# EAGLE design SmodCHPX (EAGLE 6.3)
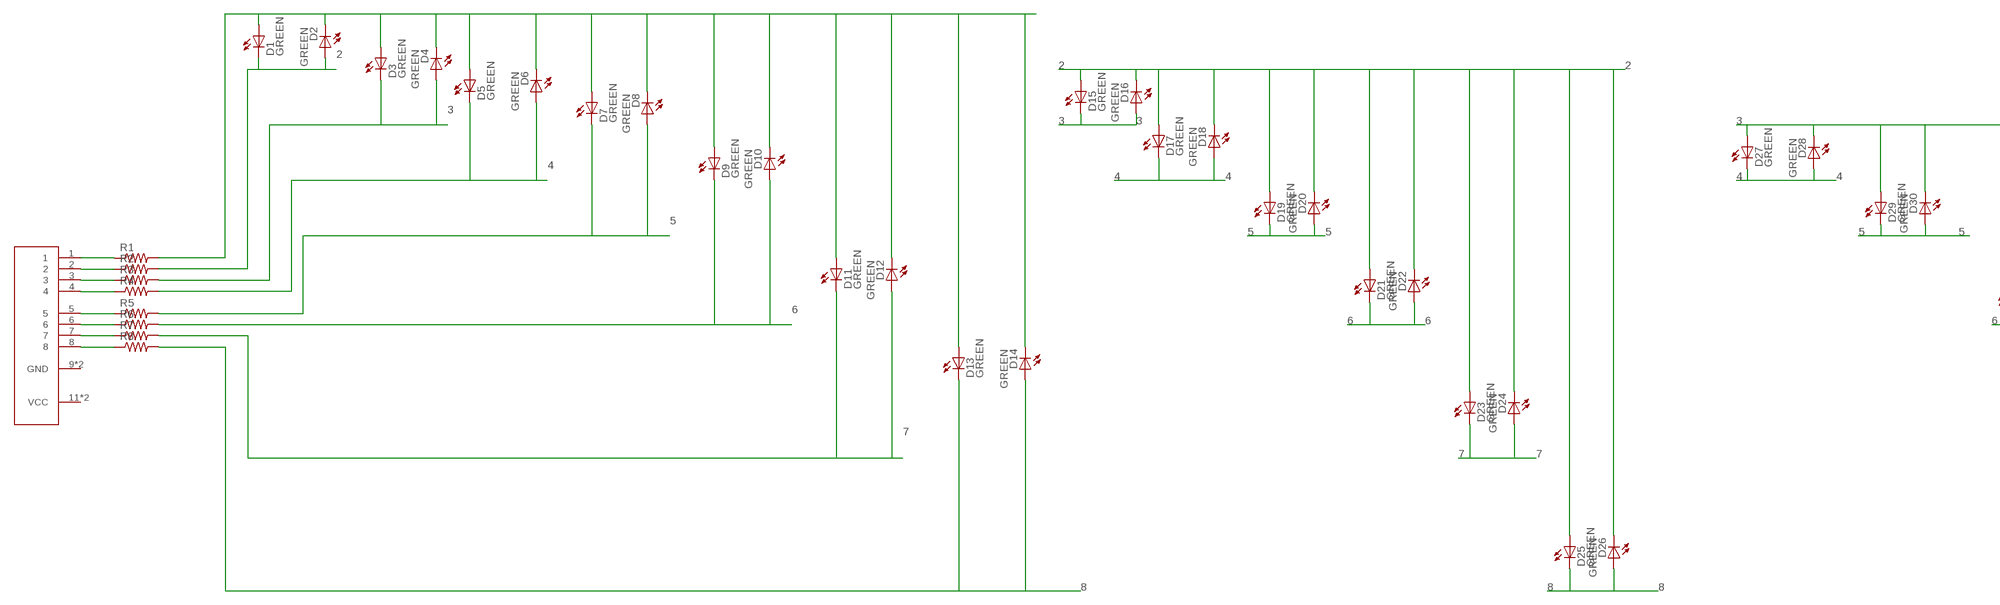
[diagram p0: schematic, sheet 1, part 1 of 2]
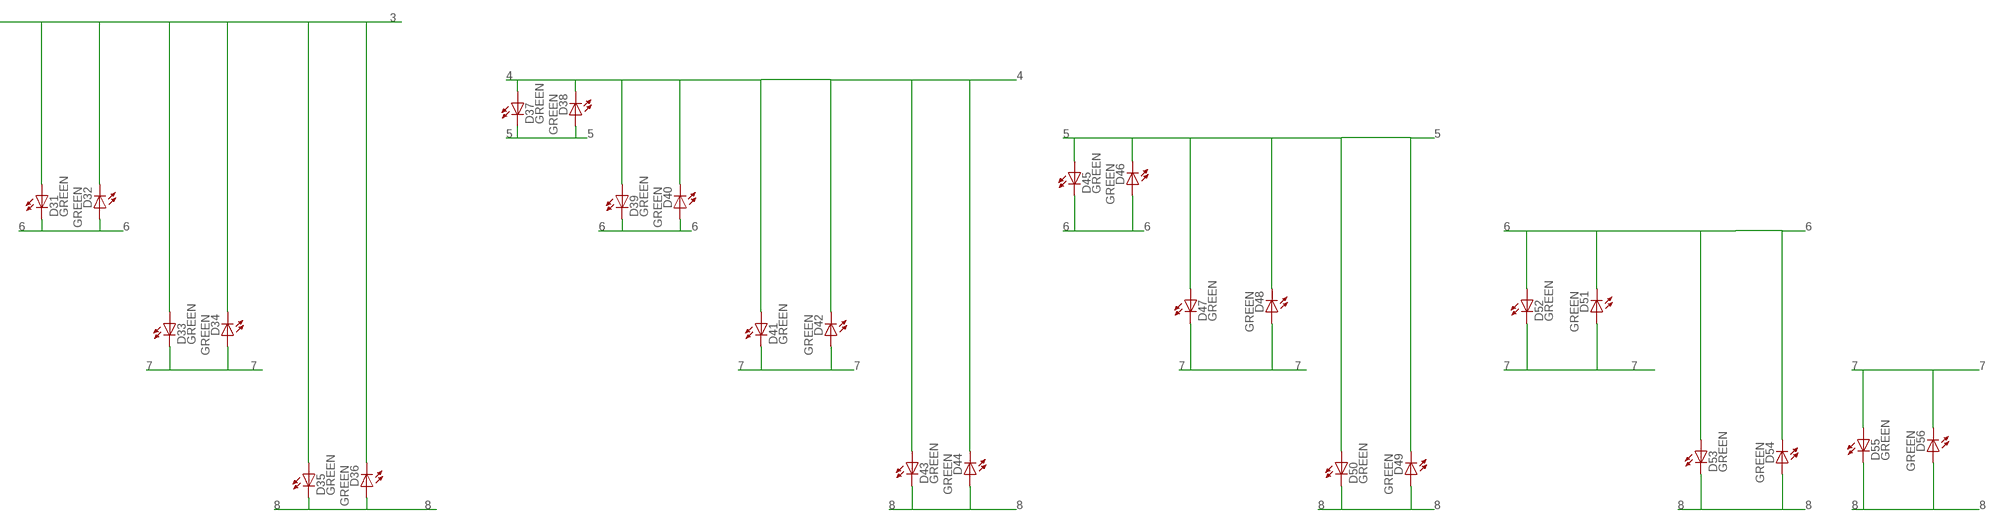
[diagram p1: schematic, sheet 1, part 2 of 2]

## Parts
D1  GREEN  LED-GREENLARGE  [LED-1206]
D2  GREEN  LED-GREENLARGE  [LED-1206]
D3  GREEN  LED-GREENLARGE  [LED-1206]
D4  GREEN  LED-GREENLARGE  [LED-1206]
D5  GREEN  LED-GREENLARGE  [LED-1206]
D6  GREEN  LED-GREENLARGE  [LED-1206]
D7  GREEN  LED-GREENLARGE  [LED-1206]
D8  GREEN  LED-GREENLARGE  [LED-1206]
D9  GREEN  LED-GREENLARGE  [LED-1206]
D10  GREEN  LED-GREENLARGE  [LED-1206]
D11  GREEN  LED-GREENLARGE  [LED-1206]
D12  GREEN  LED-GREENLARGE  [LED-1206]
D13  GREEN  LED-GREENLARGE  [LED-1206]
D14  GREEN  LED-GREENLARGE  [LED-1206]
D15  GREEN  LED-GREENLARGE  [LED-1206]
D16  GREEN  LED-GREENLARGE  [LED-1206]
D17  GREEN  LED-GREENLARGE  [LED-1206]
D18  GREEN  LED-GREENLARGE  [LED-1206]
D19  GREEN  LED-GREENLARGE  [LED-1206]
D20  GREEN  LED-GREENLARGE  [LED-1206]
D21  GREEN  LED-GREENLARGE  [LED-1206]
D22  GREEN  LED-GREENLARGE  [LED-1206]
D23  GREEN  LED-GREENLARGE  [LED-1206]
D24  GREEN  LED-GREENLARGE  [LED-1206]
D25  GREEN  LED-GREENLARGE  [LED-1206]
D26  GREEN  LED-GREENLARGE  [LED-1206]
D27  GREEN  LED-GREENLARGE  [LED-1206]
D28  GREEN  LED-GREENLARGE  [LED-1206]
D29  GREEN  LED-GREENLARGE  [LED-1206]
D30  GREEN  LED-GREENLARGE  [LED-1206]
D31  GREEN  LED-GREENLARGE  [LED-1206]
D32  GREEN  LED-GREENLARGE  [LED-1206]
D33  GREEN  LED-GREENLARGE  [LED-1206]
D34  GREEN  LED-GREENLARGE  [LED-1206]
D35  GREEN  LED-GREENLARGE  [LED-1206]
D36  GREEN  LED-GREENLARGE  [LED-1206]
D37  GREEN  LED-GREENLARGE  [LED-1206]
D38  GREEN  LED-GREENLARGE  [LED-1206]
D39  GREEN  LED-GREENLARGE  [LED-1206]
D40  GREEN  LED-GREENLARGE  [LED-1206]
D41  GREEN  LED-GREENLARGE  [LED-1206]
D42  GREEN  LED-GREENLARGE  [LED-1206]
D43  GREEN  LED-GREENLARGE  [LED-1206]
D44  GREEN  LED-GREENLARGE  [LED-1206]
D45  GREEN  LED-GREENLARGE  [LED-1206]
D46  GREEN  LED-GREENLARGE  [LED-1206]
D47  GREEN  LED-GREENLARGE  [LED-1206]
D48  GREEN  LED-GREENLARGE  [LED-1206]
D49  GREEN  LED-GREENLARGE  [LED-1206]
D50  GREEN  LED-GREENLARGE  [LED-1206]
D51  GREEN  LED-GREENLARGE  [LED-1206]
D52  GREEN  LED-GREENLARGE  [LED-1206]
D53  GREEN  LED-GREENLARGE  [LED-1206]
D54  GREEN  LED-GREENLARGE  [LED-1206]
D55  GREEN  LED-GREENLARGE  [LED-1206]
D56  GREEN  LED-GREENLARGE  [LED-1206]
R1  RESISTOR1206  [1206]
R2  RESISTOR1206  [1206]
R3  RESISTOR1206  [1206]
R4  RESISTOR1206  [1206]
R5  RESISTOR1206  [1206]
R6  RESISTOR1206  [1206]
R7  RESISTOR1206  [1206]
R8  RESISTOR1206  [1206]
U$1  PMOD  [2X6]

## Nets
1: D1.A D2.C D3.A D4.C D5.A D6.C D7.A D8.C D9.A D10.C D11.A D12.C D13.A D14.C R1.2
2: D1.C D2.A D15.A D16.C D17.A D18.C D19.A D20.C D21.A D22.C D23.A D24.C D25.A D26.C R2.2
3: D3.C D4.A D15.C D16.A D27.A D28.C D29.A D30.C D31.A D32.C D33.A D34.C D35.A D36.C R3.2
4: D5.C D6.A D17.C D18.A D27.C D28.A D37.A D38.C D39.A D40.C D41.A D42.C D43.A D44.C R4.2
5: D7.C D8.A D19.C D20.A D29.C D30.A D37.C D38.A D45.A D46.C D47.A D48.C D49.C D50.A R5.2
6: D9.C D10.A D21.C D22.A D31.C D32.A D39.C D40.A D45.C D46.A D51.C D52.A D53.A D54.C R6.2
7: D11.C D12.A D23.C D24.A D33.C D34.A D41.C D42.A D47.C D48.A D51.A D52.C D55.A D56.C R7.2
8: D13.C D14.A D25.C D26.A D35.C D36.A D43.C D44.A D49.A D50.C D53.C D54.A D55.C D56.A R8.2
N$9: R1.1 U$1.1
N$10: R2.1 U$1.2
N$11: R3.1 U$1.3
N$12: R4.1 U$1.4
N$13: R5.1 U$1.5
N$14: R6.1 U$1.6
N$15: R7.1 U$1.7
N$16: R8.1 U$1.8
Unconnected: U$1.9(GND) U$1.10(GND) U$1.11(VCC) U$1.12(VCC)

## Library data of the parts
D1-D56 = SparkFun-LED:LED-GREEN: Various green LEDs 0603- DIO-00821 LARGE- DIO-00862 LILYPAD- DIO-09910; PROD_ID: DIO-00862
R1-R8 = SparkFun-Passives:RESISTOR: Resistor Basic schematic elements and footprints for 0603, 1206, and PTH resistors.
U$1 = Strutz Electronic Industries:PMOD

## Board
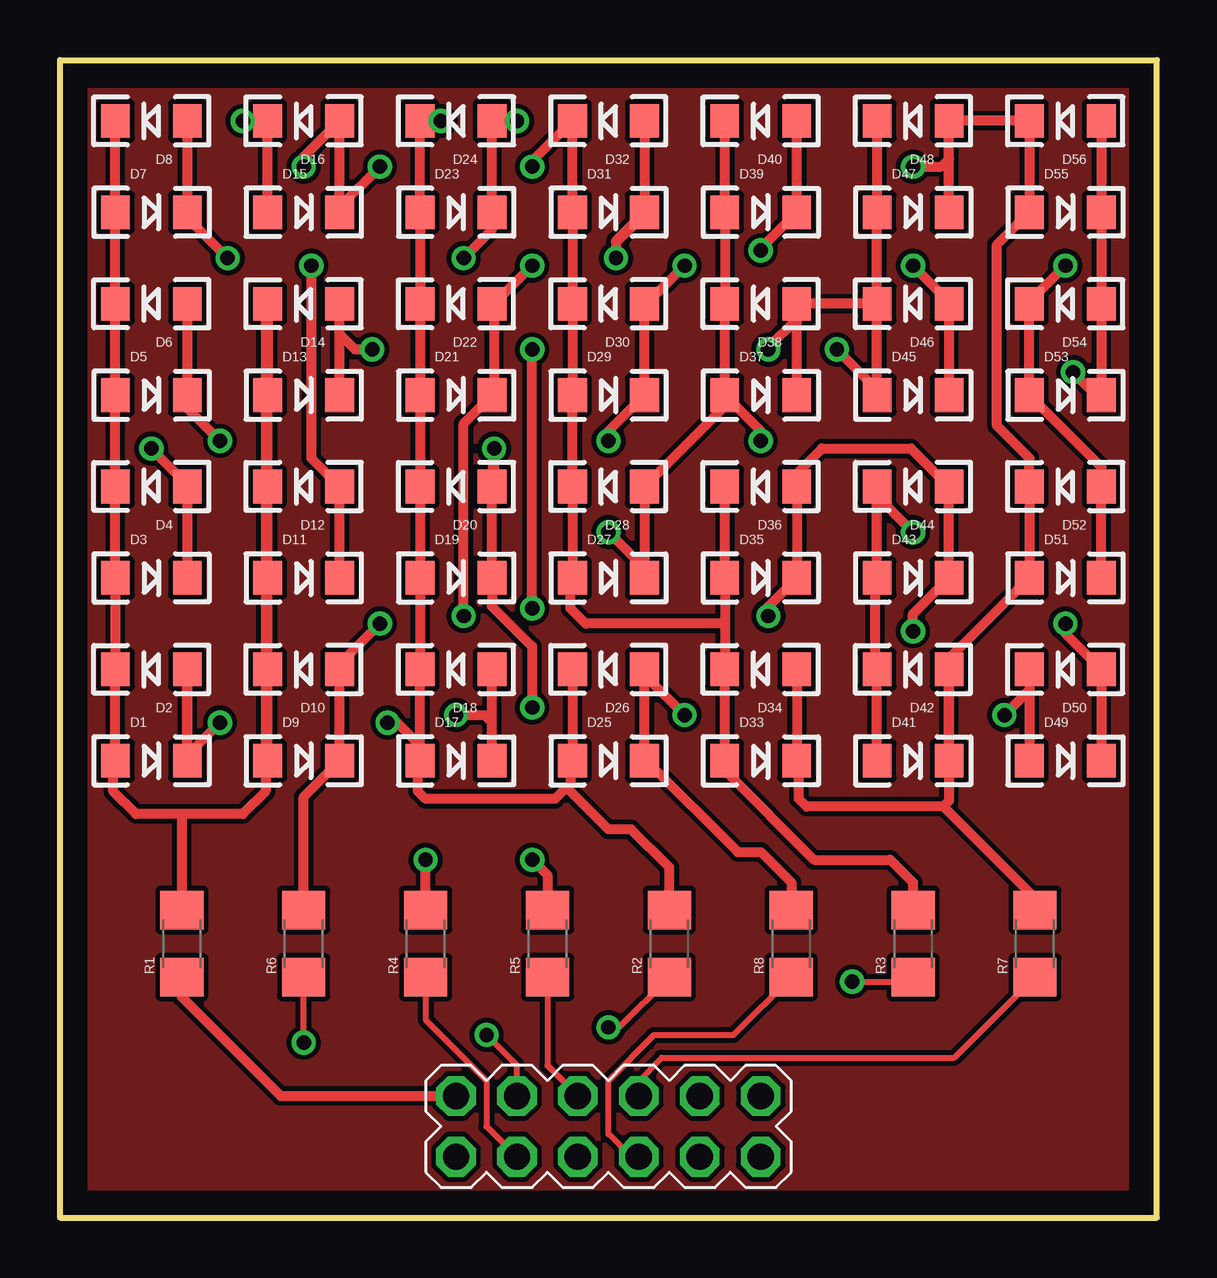
[diagram p2: board, top side]
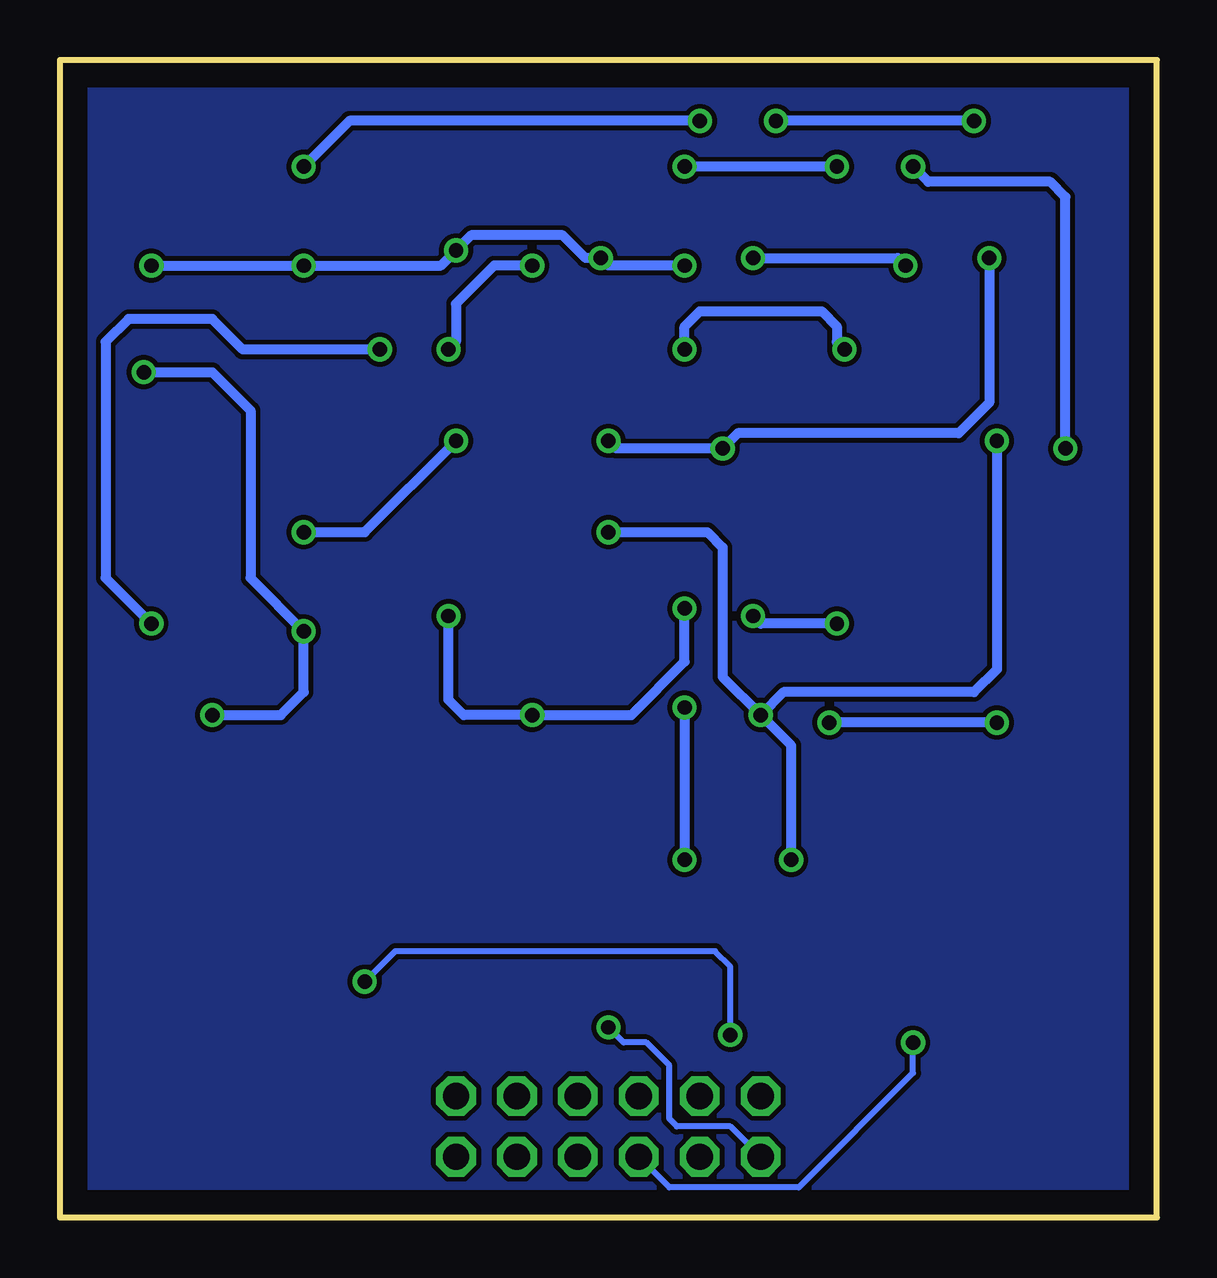
[diagram p3: board, bottom side, seen from below]

Size 45.72 x 48.26 mm. Coordinates in mm from the lower left corner, seen from the top.
Outline: 0,0 0,48.26 45.72,48.26 45.72,0 0,0
Copper layers (1*16): Top 0.035mm / dielectric 1.5mm / Bottom 0.035mm
Design rules "default": minimum track width 10mil, minimum drill 24mil, track to track 8mil, track to pad 8mil, pad to pad 8mil, via to via 8mil, smd to smd 8mil, copper to edge 40mil, drill to drill 8mil, minimum pad ring 10mil, minimum via ring 8mil, stop-mask expansion 4mil, vias tented up to drill 0mil, thermal gap 10mil

### Footprints (pad centres in the part's own frame; a part is rotated, then mirrored left to right if it is on the bottom)
LED-1206 = smd 1.2 x 1.4: A -1.5,0; C 1.5,0
1206 = smd 1.6 x 1.8: 1 -1.4,0; 2 1.4,0
2X6 = drill 1.1 octagon: 1 -6.35,1.27; 2 -6.35,-1.27; 3 -3.81,1.27; 4 -3.81,-1.27; 5 -1.27,1.27; 6 -1.27,-1.27; 7 1.27,1.27; 8 1.27,-1.27; 9 3.81,1.27; 10 3.81,-1.27; 11 6.35,1.27; 12 6.35,-1.27

### Placement (x,y rotation side)
D1  3.81,19.05 0 top
D2  3.81,22.86 180 top
D3  3.81,26.67 0 top
D4  3.81,30.48 180 top
D5  3.81,34.29 0 top
D6  3.81,38.1 180 top
D7  3.81,41.91 0 top
D8  3.81,45.72 180 top
D9  10.16,19.05 0 top
D10  10.16,22.86 180 top
D11  10.16,26.67 0 top
D12  10.16,30.48 180 top
D13  10.16,34.29 0 top
D14  10.16,38.1 180 top
D15  10.16,41.91 0 top
D16  10.16,45.72 180 top
D17  16.51,19.05 0 top
D18  16.51,22.86 180 top
D19  16.51,26.67 0 top
D20  16.51,30.48 180 top
D21  16.51,34.29 0 top
D22  16.51,38.1 180 top
D23  16.51,41.91 0 top
D24  16.51,45.72 180 top
D25  22.86,19.05 0 top
D26  22.86,22.86 180 top
D27  22.86,26.67 0 top
D28  22.86,30.48 180 top
D29  22.86,34.29 0 top
D30  22.86,38.1 180 top
D31  22.86,41.91 0 top
D32  22.86,45.72 180 top
D33  29.21,19.05 0 top
D34  29.21,22.86 180 top
D35  29.21,26.67 0 top
D36  29.21,30.48 180 top
D37  29.21,34.29 0 top
D38  29.21,38.1 180 top
D39  29.21,41.91 0 top
D40  29.21,45.72 180 top
D41  35.56,19.05 0 top
D42  35.56,22.86 180 top
D43  35.56,26.67 0 top
D44  35.56,30.48 180 top
D45  35.56,34.29 0 top
D46  35.56,38.1 180 top
D47  35.56,41.91 0 top
D48  35.56,45.72 180 top
D49  41.91,19.05 0 top
D50  41.91,22.86 180 top
D51  41.91,26.67 0 top
D52  41.91,30.48 180 top
D53  41.91,34.29 0 top
D54  41.91,38.1 180 top
D55  41.91,41.91 0 top
D56  41.91,45.72 180 top
R1  5.08,11.43 90 top
R2  25.4,11.43 90 top
R3  35.56,11.43 90 top
R4  15.24,11.43 90 top
R5  20.32,11.43 90 top
R6  10.16,11.43 90 top
R7  40.64,11.43 90 top
R8  30.48,11.43 90 top
U$1  22.86,3.81 0 top

### Tracks (layer width: path | path; a pad name or v marks a point on that pad's centre or on a via)
1
  Top 0.406: D8.C D7.A D6.C D5.A D4.C D3.A D2.C D1.A 2.22,18.96 2.22,17.78 3.18,16.83 5.08,16.83 | D9.A D10.C D11.A D12.C D13.A D14.C 8.57,38.1 8.57,17.78 7.62,16.83 5.08,16.83 | 5.08,16.83 R1.2
2  (via drill 0.6)
  Top 0.406: D1.C D2.A 5.31,19.14 5.4,19.05 5.4,19.37 v6.67,20.64 | D15.A D16.C v7.62,45.72 | 15.01,19.69 D17.A 14.92,18.96 14.92,17.78 15.24,17.46 20.64,17.46 21.11,17.94 | 15.01,19.69 D18.C D19.A D20.C D21.A D22.C D23.A D24.C v15.88,45.72 | D25.A D26.C 21.36,19.14 21.27,19.05 21.27,18.1 21.11,17.94 | v13.65,20.64 14.06,20.64 15.01,19.69 | R2.2 25.4,14.6 23.81,16.19 22.86,16.19 21.11,17.94
  Bottom 0.406: v6.67,20.64 v13.65,20.64 | v7.62,45.72 v15.88,45.72
3  (via drill 0.6)
  Top 0.406: D3.C D4.A 5.31,30.57 v3.81,32.07 | D35.A D34.C D33.A 27.71,18.65 31.43,14.92 34.61,14.92 35.56,13.97 R3.2 35.2,12.83 | D35.A D36.C | v10.16,43.82 10.16,44.22 D16.A D15.C 11.66,42.14 v13.34,43.82 | v19.68,43.82 19.68,44.05 D32.C D31.A D30.C D29.A D28.C D27.A 21.27,26.58 21.27,25.4 21.91,24.77 27.62,24.77 27.71,24.85 D35.A
  Bottom 0.406: v3.81,32.07 3.81,42.55 4.45,43.18 9.52,43.18 v10.16,43.82 | v13.34,43.82 v19.68,43.82
4  (via drill 0.6)
  Top 0.406: D6.A D5.C 5.31,33.74 v6.67,32.39 | D17.C 18.01,20.64 | 18.01,20.64 D18.A | D41.A D42.C 33.97,22.95 33.97,26.67 D43.A D44.C 34.06,30.08 v35.56,28.58 | D40.C D39.A D38.C D37.A | v16.51,20.95 17.69,20.95 18.01,20.64 | v29.21,32.39 29.21,32.79 D37.A | D37.A 27.71,33.83 D28.A D27.C 24.36,27.08 v22.86,28.58 | R4.2 v15.24,14.92
  Bottom 0.406: v6.67,32.39 6.67,22.86 7.62,21.91 15.56,21.91 v16.51,20.95 | v35.56,28.58 33.02,28.58 v29.21,32.39 | v22.86,28.58 18.73,28.58 18.1,27.94 18.1,22.54 v16.51,20.95 | v15.24,14.92 15.24,19.69 v16.51,20.95
5  (via drill 0.6)
  Top 0.406: D8.A D7.C 5.31,41.68 v6.98,40.01 | D20.A D19.C 18.01,25.49 19.68,23.81 v19.68,21.27 | D46.C D45.A 34.06,34.52 v32.39,36.2 | D46.C D47.A D48.C | D37.C 30.71,37.47 | 30.71,37.47 D38.A D46.C | D49.C D50.A 41.91,24.36 v41.91,24.77 | D20.A 18.1,30.39 v18.1,32.07 18.01,30.57 D20.A | v26.04,39.69 24.45,38.1 D30.A D29.C 22.86,32.79 v22.86,32.39 | v29.53,36.2 29.53,36.28 30.71,37.47 | v19.68,14.92 20.32,14.29 R5.2
  Bottom 0.406: v6.98,40.01 6.98,33.97 8.25,32.7 17.46,32.7 v18.1,32.07 22.54,32.07 v22.86,32.39 | v32.39,36.2 38.1,36.2 39.37,37.47 42.86,37.47 43.81,36.51 43.81,26.67 v41.91,24.77 | v26.04,39.69 27.62,39.69 29.21,38.1 29.21,36.51 v29.53,36.2 | v19.68,21.27 v19.68,14.92
6  (via drill 0.6)
  Top 0.406: D22.A 18.1,38.1 | 18.1,38.1 18.1,34.38 D21.C 16.83,33.11 v16.83,25.08 | D45.C D46.A 37.06,38.19 v35.56,39.69 | D40.A D39.C 29.21,40.41 v29.21,40.32 | D51.C D52.A 43.41,31.29 D53.A D54.C 40.41,38.19 v41.91,39.69 | 18.1,38.1 v19.68,39.69 | 23.18,40.64 23.18,40.73 D31.C | v13.34,24.77 11.66,23.09 D10.A D9.C 10.16,17.55 R6.2 | D32.A D31.C | D31.C 24.36,41.82 23.18,40.64 | 23.18,40.64 v23.18,40.01
  Bottom 0.406: v41.91,39.69 v35.56,39.69 29.85,39.69 v29.21,40.32 28.57,40.96 24.76,40.96 23.81,40.01 v23.18,40.01 22.86,39.69 v19.68,39.69 | v13.34,24.77 16.51,24.77 v16.83,25.08
7  (via drill 0.6)
  Top 0.406: D34.A D33.C 30.8,18.96 30.8,17.46 31.11,17.15 36.83,17.15 | D41.C D42.A | D42.A 37.06,17.38 36.83,17.15 | D42.A 37.06,23.32 D51.A D52.C 40.41,31.66 39.05,33.02 39.05,40.55 D55.A D56.C D48.A 37.06,44.13 | D47.C 37.06,44.13 | D11.C D12.A 10.48,31.66 v10.48,39.69 | v16.83,40.01 18.01,41.19 D23.C D24.A v19.05,45.72 | R7.2 40.64,13.33 36.83,17.15 | v35.56,43.82 36.74,43.82 37.06,44.13
  Bottom 0.406: v16.83,40.01 10.79,40.01 v10.48,39.69 | v19.05,45.72 33.66,45.72 v35.56,43.82
8  (via drill 0.6)
  Top 0.406: D49.A D50.C 40.41,21.99 v39.37,20.95 | v35.56,24.45 35.56,25.17 D43.C D44.A 35.47,32.07 31.75,32.07 30.71,31.03 D36.A D35.C 29.53,25.49 v29.53,25.08 | D56.A D55.C D54.A D53.C 43.18,34.29 v42.23,35.24 | D13.C 11.66,36.83 | 11.66,36.83 D14.A | v26.04,20.95 24.36,22.63 D26.A D25.C 24.45,19.05 28.26,15.24 29.21,15.24 30.48,13.97 R8.2 | v19.68,25.4 v19.68,36.2 | v13.02,36.2 12.29,36.2 11.66,36.83
  Bottom 0.406: v39.37,20.95 36.51,20.95 35.56,21.91 v35.56,24.45 37.78,26.67 37.78,33.66 39.37,35.24 v42.23,35.24 | v29.53,25.08 29.53,21.59 28.89,20.95 v26.04,20.95 21.91,20.95 19.68,23.18 v19.68,25.4 | v19.68,36.2 19.68,37.15 19.05,37.78 13.97,37.78 13.34,37.15 13.34,36.51 v13.02,36.2
GND
  pour Bottom: 0,0 45.72,0 45.72,48.26 0,48.26
  pour Top: 0,0 45.72,0 45.72,48.26 0,48.26
N$9
  Top 0.406: R1.1 5.08,9.21 9.21,5.08 U$1.1
N$10  (via drill 0.6)
  Top 0.254: v22.86,7.94 23.31,7.94 R2.1
  Bottom 0.254: U$1.2 17.78,3.81 20,3.81 20.32,4.13 20.32,6.35 21.27,7.3 22.22,7.3 v22.86,7.94
N$11  (via drill 0.6)
  Top 0.254: U$1.3 19.05,6.35 v17.78,7.62 | v33.02,9.84 35.37,9.84 R3.1
  Bottom 0.254: v17.78,7.62 17.78,10.48 18.41,11.11 31.75,11.11 v33.02,9.84
N$12
  Top 0.254: R4.1 15.24,8.26 17.78,5.71 17.78,3.81 U$1.4
N$13
  Top 0.254: R5.1 20.32,6.35 U$1.5
N$14  (via drill 0.6)
  Top 0.254: v10.16,7.3 R6.1
  Bottom 0.254: v10.16,7.3 10.16,6.03 14.92,1.27 20.32,1.27 U$1.6
N$15
  Top 0.254: U$1.7 24.13,5.71 25.08,6.67 37.28,6.67 R7.1
N$16
  Top 0.254: U$1.8 23.81,2.54 22.86,3.49 22.86,5.71 24.76,7.62 28.07,7.62 R8.1

### Text on the board
_bsilk: Designed by Shannon Strutz / for the University of Wisconsin - Stout / UW-Stout IEEE 2013